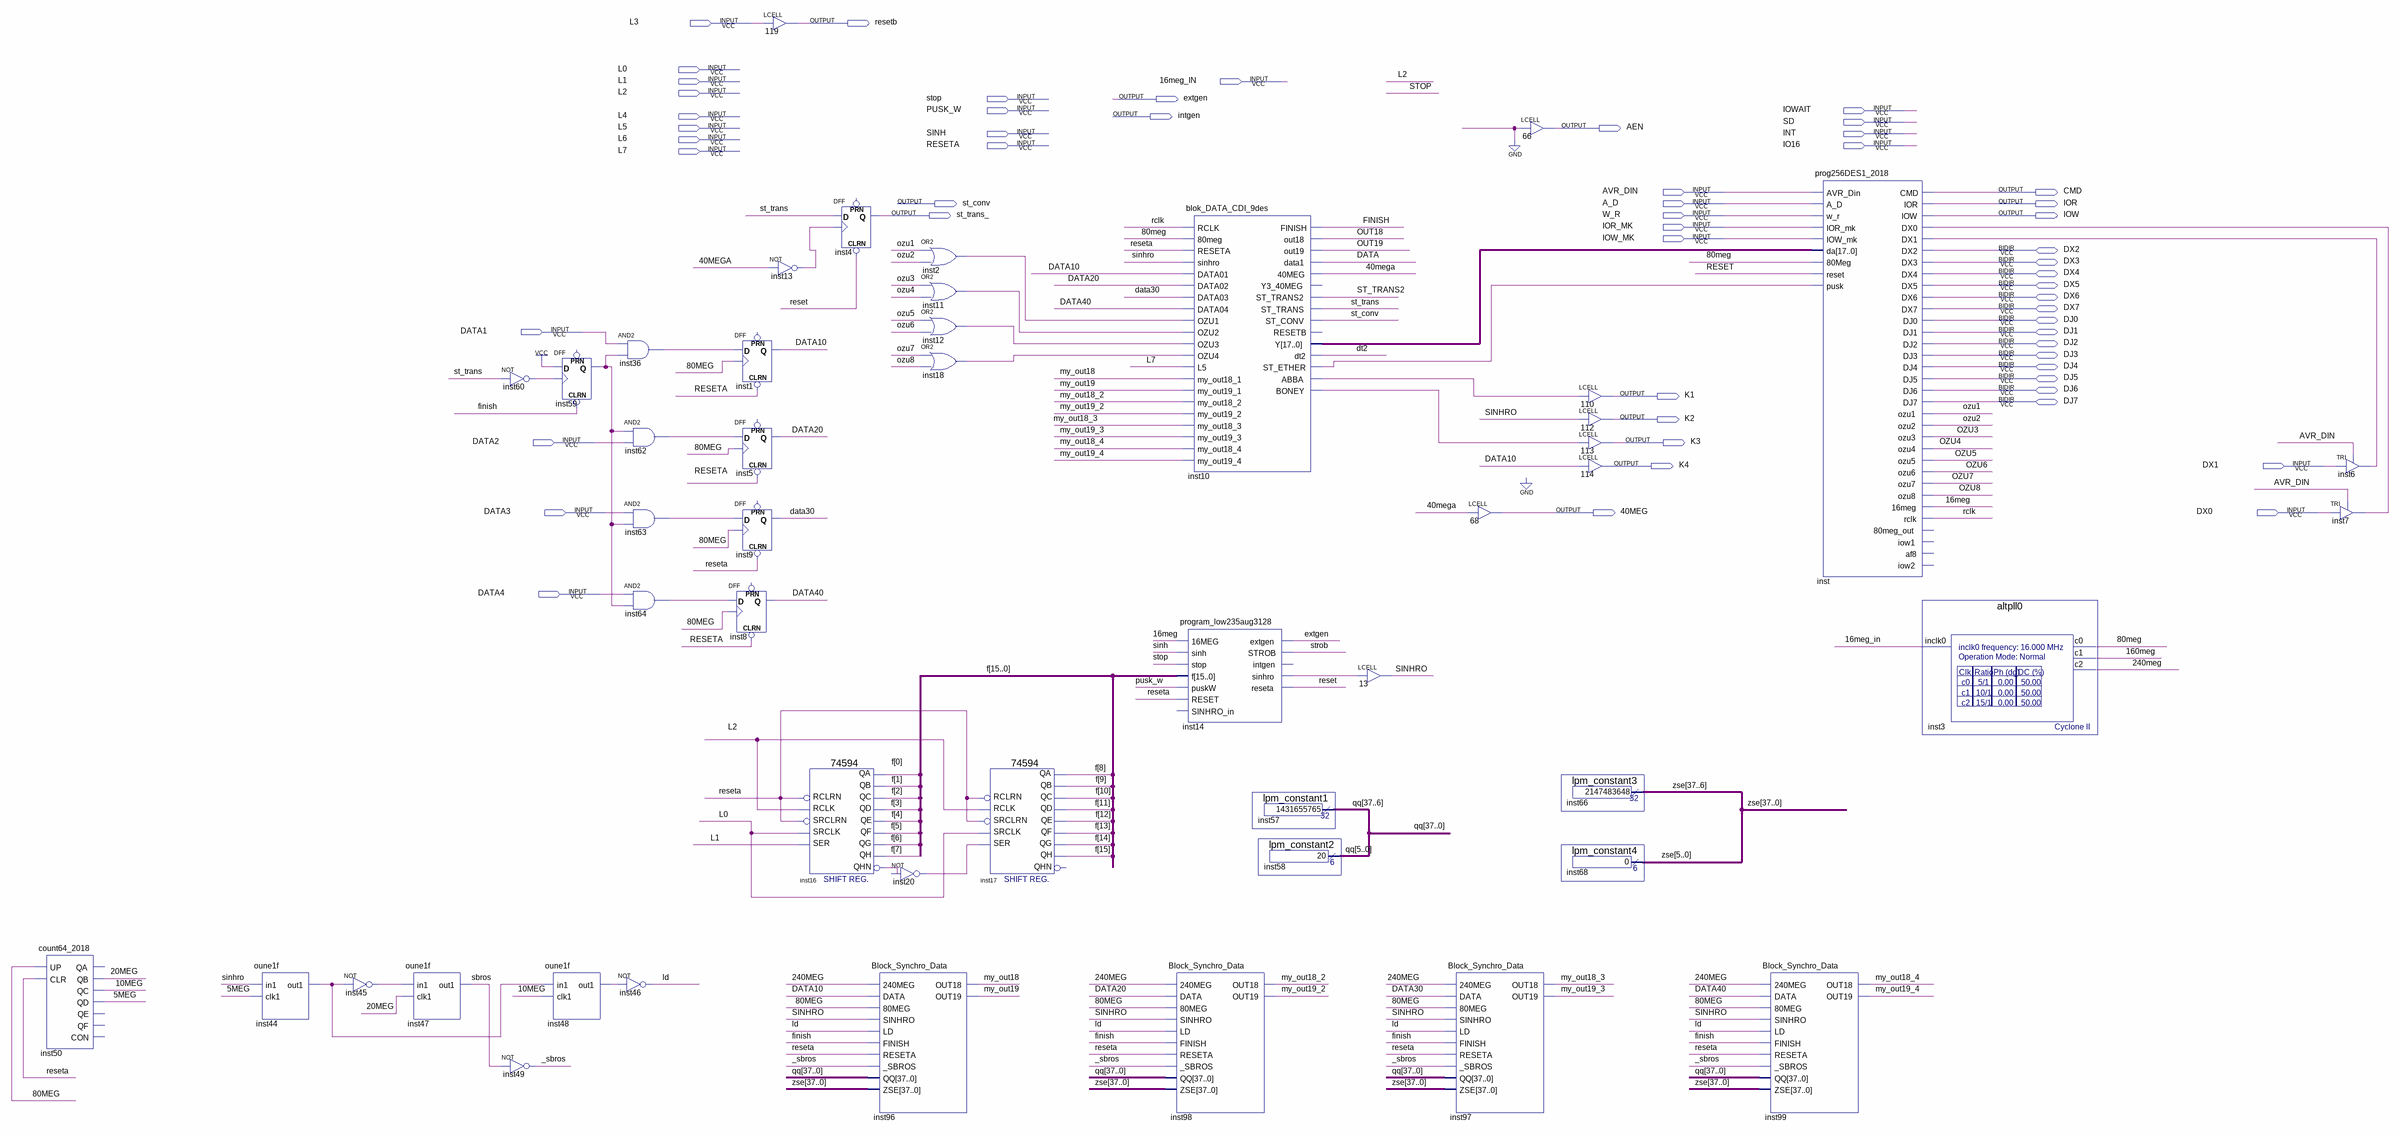
[diagram p0: schematic sheet]
// Quartus schematic program_CU_2018.bdf as structural Verilog: 48 symbols, 56 pins
module program_CU_2018 (
  input  L3,
  input  L0,
  input  L1,
  input  \16meg_IN ,
  input  L2,
  input  stop,
  input  PUSK_W,
  input  IOWAIT,
  input  L4,
  input  SD,
  input  L5,
  input  SINH,
  input  INT,
  input  L6,
  input  RESETA,
  input  IO16,
  input  L7,
  input  AVR_DIN,
  input  A_D,
  input  W_R,
  input  IOR_MK,
  input  IOW_MK,
  input  DATA1,
  input  DATA2,
  input  DX1,
  input  DATA3,
  input  DX0,
  input  DATA4,
  inout  DX2,
  inout  DX3,
  inout  DX4,
  inout  DX5,
  inout  DX6,
  inout  DX7,
  inout  DJ0,
  inout  DJ1,
  inout  DJ2,
  inout  DJ3,
  inout  DJ4,
  inout  DJ5,
  inout  DJ6,
  inout  DJ7,
  output resetb,
  output extgen,
  output intgen,
  output AEN,
  output CMD,
  output st_conv,
  output IOR,
  output st_trans_,
  output IOW,
  output K1,
  output K2,
  output K3,
  output K4,
  output \40MEG 
);

  wire \5MEG , \10MEG , \16meg , \20MEG , \40mega , \80meg , \160meg , \240meg , _sbros, DATA, DATA10,
       DATA20, data30, DATA40, dt2, FINISH, inst2_out, inst10_abba, inst10_boney, inst10_st_ether,
       inst11_out, inst12_out, inst13_out, inst14_sinhro, inst16_qhn, inst18_out, inst20_out, inst36_out,
       inst44_out1, inst45_out, inst48_out1, inst59_q, inst60_out, inst62_out, inst63_out, inst64_out,
       inst_dx0, inst_dx1, ld, my_out18, my_out18_2, my_out18_3, my_out18_4, my_out19, my_out19_2,
       my_out19_3, my_out19_4, OUT18, OUT19, ozu1, ozu2, OZU3, OZU4, OZU5, OZU6, OZU7, OZU8, rclk, RESET,
       sbros, SINHRO, st_trans, ST_TRANS2, strob;
  wire [15:0] f;
  wire [17:0] inst10_y;
  wire [37:0] qq, zse;

  count64_2018 inst50 (.UP(\80meg ), .CLR(RESETA), .QB(\20MEG ), .QC(\10MEG ), .QD(\5MEG ));  // open: QA, QE, QF, CON
  oune1f inst44 (.in1(SINHRO), .clk1(\5MEG ), .out1(inst44_out1));
  not inst45 (inst45_out, inst44_out1);
  oune1f inst47 (.in1(inst45_out), .clk1(\20MEG ), .out1(sbros));
  not inst60 (inst60_out, st_trans);
  not inst49 (_sbros, sbros);
  DFF inst59 (.CLRN(FINISH), .CLK(inst60_out), .D(1'b1), .Q(inst59_q));  // open: PRN
  oune1f inst48 (.in1(inst44_out1), .clk1(\10MEG ), .out1(inst48_out1));
  and inst36 (inst36_out, DATA1, inst59_q);
  and inst62 (inst62_out, inst59_q, DATA2);
  and inst63 (inst63_out, DATA3, inst59_q);
  and inst64 (inst64_out, DATA4, inst59_q);
  not inst46 (ld, inst48_out1);
  LCELL u_119 (.IN(L3), .OUT(resetb));
  not inst13 (inst13_out, \40mega );
  DFF inst1 (.CLRN(RESETA), .CLK(\80meg ), .D(inst36_out), .Q(DATA10));  // open: PRN
  DFF inst5 (.CLRN(RESETA), .CLK(\80meg ), .D(inst62_out), .Q(DATA20));  // open: PRN
  DFF inst9 (.CLRN(RESETA), .CLK(\80meg ), .D(inst63_out), .Q(data30));  // open: PRN
  DFF inst8 (.CLRN(RESETA), .CLK(\80meg ), .D(inst64_out), .Q(DATA40));  // open: PRN
  \74594  inst16 (
    .SRCLRN(RESETA), .SRCLK(L0), .RCLK(L2), .RCLRN(RESETA), .SER(L1), .QC(f[2]), .QG(f[6]), .QHN(inst16_qhn),
    .QH(f[7]), .QA(f[0]), .QB(f[1]), .QD(f[3]), .QE(f[4]), .QF(f[5]));
  DFF inst4 (.CLRN(RESET), .CLK(inst13_out), .D(st_trans), .Q(st_trans_));  // open: PRN
  not inst20 (inst20_out, inst16_qhn);
  Block_Synchro_Data inst96 (
    .\240MEG (\240meg ), .DATA(DATA10), .\80MEG (\80meg ), .SINHRO(SINHRO), .LD(ld), .FINISH(FINISH),
    .RESETA(RESETA), ._SBROS(_sbros), .QQ(qq), .ZSE(zse), .OUT18(my_out18), .OUT19(my_out19));
  or inst2 (inst2_out, ozu1, ozu2);
  or inst11 (inst11_out, OZU3, OZU4);
  or inst12 (inst12_out, OZU5, OZU6);
  or inst18 (inst18_out, OZU7, OZU8);
  \74594  inst17 (
    .SRCLRN(RESETA), .SRCLK(L0), .RCLK(L2), .RCLRN(RESETA), .SER(inst20_out), .QC(f[10]), .QG(f[14]),
    .QH(f[15]), .QA(f[8]), .QB(f[9]), .QD(f[11]), .QE(f[12]), .QF(f[13]));  // open: QHN
  blok_DATA_CDI_9des inst10 (
    .RCLK(rclk), .\80meg (\80meg ), .RESETA(RESETA), .sinhro(SINHRO), .DATA01(DATA10), .DATA02(DATA20),
    .DATA03(data30), .DATA04(DATA40), .OZU1(inst2_out), .OZU2(inst11_out), .OZU3(inst12_out),
    .OZU4(inst18_out), .L5(L7), .my_out18_1(my_out18), .my_out19_1(my_out19), .my_out18_2(my_out18_2),
    .my_out19_2(my_out19_2), .my_out18_3(my_out18_3), .my_out19_3(my_out19_3), .my_out18_4(my_out18_4),
    .my_out19_4(my_out19_4), .FINISH(FINISH), .out18(OUT18), .out19(OUT19), .data1(DATA), .\40MEG (\40mega ),
    .ST_TRANS2(ST_TRANS2), .ST_TRANS(st_trans), .ST_CONV(st_conv), .Y(inst10_y), .dt2(dt2),
    .ST_ETHER(inst10_st_ether), .ABBA(inst10_abba), .BONEY(inst10_boney));  // open: Y3_40MEG, RESETB
  program_low235aug3128 inst14 (
    .\16MEG (\16meg ), .sinh(SINH), .stop(stop), .f(f), .puskW(PUSK_W), .RESET(RESETA), .extgen(extgen),
    .STROB(strob), .sinhro(inst14_sinhro), .reseta(RESET));  // open: SINHRO_in, intgen
  Block_Synchro_Data inst98 (
    .\240MEG (\240meg ), .DATA(DATA20), .\80MEG (\80meg ), .SINHRO(SINHRO), .LD(ld), .FINISH(FINISH),
    .RESETA(RESETA), ._SBROS(_sbros), .QQ(qq), .ZSE(zse), .OUT18(my_out18_2), .OUT19(my_out19_2));
  lpm_constant1 inst57 (.result(qq[37:6]));
  lpm_constant2 inst58 (.result(qq[5:0]));
  LCELL u_13 (.IN(inst14_sinhro), .OUT(SINHRO));
  LCELL u_68 (.IN(\40mega ), .OUT(\40MEG ));
  Block_Synchro_Data inst97 (
    .\240MEG (\240meg ), .DATA(data30), .\80MEG (\80meg ), .SINHRO(SINHRO), .LD(ld), .FINISH(FINISH),
    .RESETA(RESETA), ._SBROS(_sbros), .QQ(qq), .ZSE(zse), .OUT18(my_out18_3), .OUT19(my_out19_3));
  LCELL u_66 (.IN(1'b0), .OUT(AEN));
  lpm_constant3 inst66 (.result(zse[37:6]));
  lpm_constant4 inst68 (.result(zse[5:0]));
  LCELL u_110 (.IN(inst10_abba), .OUT(K1));
  LCELL u_112 (.IN(SINHRO), .OUT(K2));
  LCELL u_113 (.IN(inst10_boney), .OUT(K3));
  LCELL u_114 (.IN(DATA10), .OUT(K4));
  Block_Synchro_Data inst99 (
    .\240MEG (\240meg ), .DATA(DATA40), .\80MEG (\80meg ), .SINHRO(SINHRO), .LD(ld), .FINISH(FINISH),
    .RESETA(RESETA), ._SBROS(_sbros), .QQ(qq), .ZSE(zse), .OUT18(my_out18_4), .OUT19(my_out19_4));
  prog256DES1_2018 inst (
    .AVR_Din(AVR_DIN), .A_D(A_D), .w_r(W_R), .IOR_mk(IOR_MK), .IOW_mk(IOW_MK), .da(inst10_y),
    .\80Meg (\80meg ), .reset(RESET), .pusk(inst10_st_ether), .CMD(CMD), .IOR(IOR), .IOW(IOW), .ozu1(ozu1),
    .ozu2(ozu2), .ozu3(OZU3), .ozu4(OZU4), .ozu5(OZU5), .ozu6(OZU6), .ozu7(OZU7), .ozu8(OZU8),
    .\16meg (\16meg ), .rclk(rclk), .DX0(inst_dx0), .DX1(inst_dx1), .DX2(DX2), .DX3(DX3), .DX4(DX4),
    .DX5(DX5), .DX6(DX6), .DX7(DX7), .DJ0(DJ0), .DJ1(DJ1), .DJ2(DJ2), .DJ3(DJ3), .DJ4(DJ4), .DJ5(DJ5),
    .DJ6(DJ6), .DJ7(DJ7));  // open: 80meg_out, iow1, af8, iow2
  altpll0 inst3 (.inclk0(\16meg_IN ), .c0(\80meg ), .c1(\160meg ), .c2(\240meg ));
  TRI inst6 (.IN(DX1), .OE(AVR_DIN), .OUT(inst_dx1));
  TRI inst7 (.IN(DX0), .OE(AVR_DIN), .OUT(inst_dx0));
endmodule
